# Altium schematic sheet 01-Title_Page.SchDoc
size A; SheetNumber: 1; SheetTotal: 10
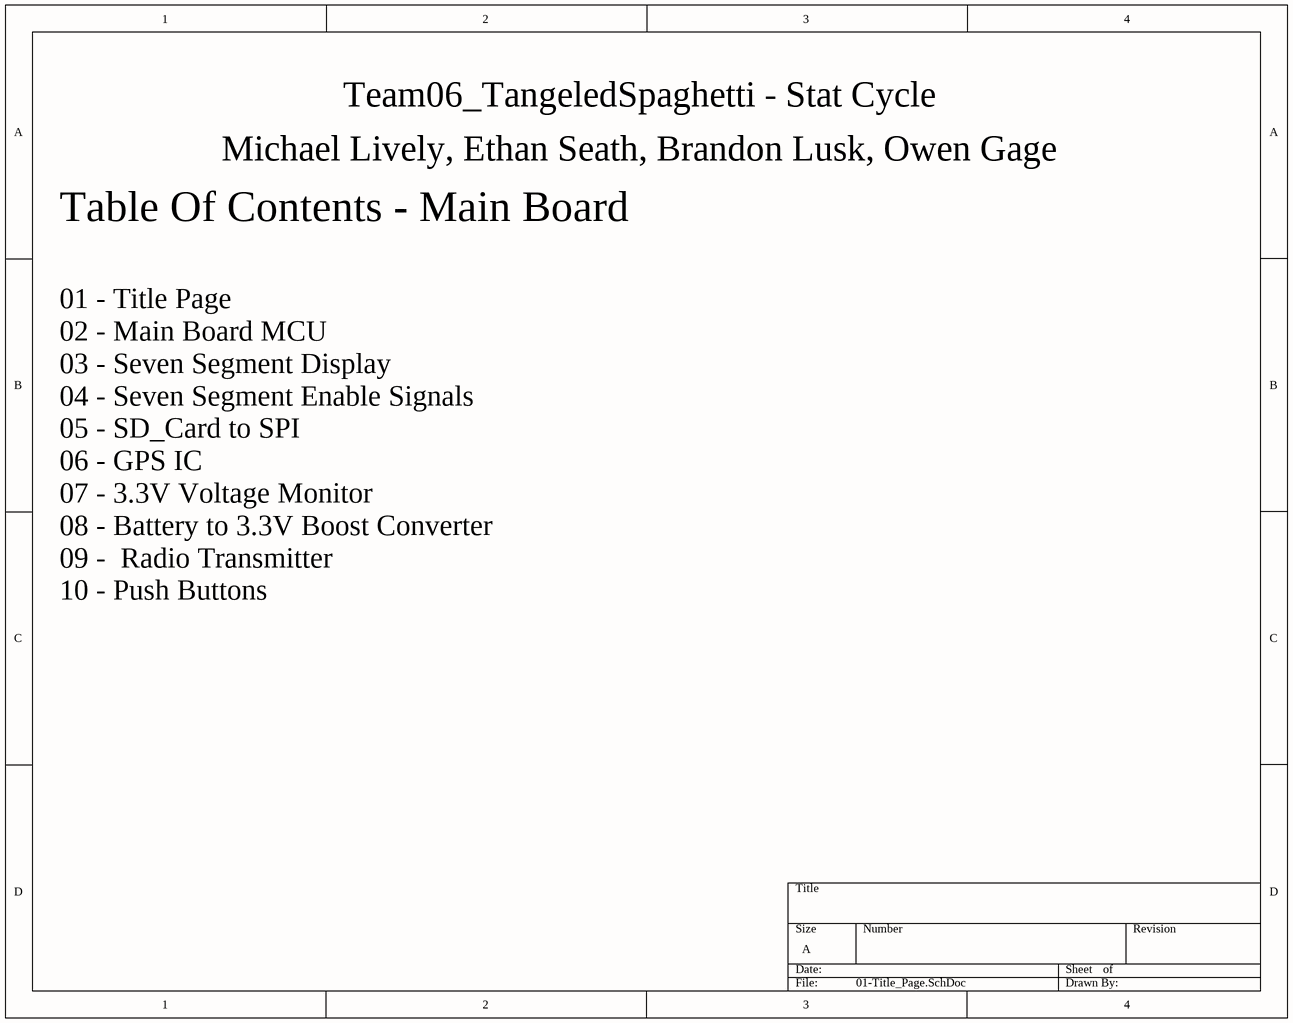
[diagram p0: 01-Title_Page.SchDoc]

## Notes on the sheet
- Team06_TangeledSpaghetti - Stat Cycle
- Michael Lively, Ethan Seath, Brandon Lusk, Owen Gage
- Table Of Contents - Main Board
- 01 - Title Page
  02 - Main Board MCU
  03 - Seven Segment Display
  04 - Seven Segment Enable Signals
  05 - SD_Card to SPI
  06 - GPS IC
  07 - 3.3V Voltage Monitor
  08 - Battery to 3.3V Boost Converter
  09 -  Radio Transmitter
  10 - Push Buttons